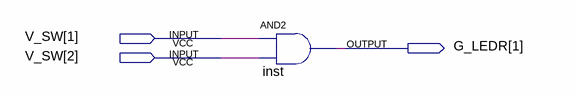
[diagram p0: schematic sheet]
// Quartus schematic labslandtest.bdf as structural Verilog: 1 symbols, 3 pins
module labslandtest (
  input  [2:1] V_SW,
  output [1:1] G_LEDR
);

  and inst (G_LEDR[1], V_SW[1], V_SW[2]);
endmodule
